# Altium project Mother_PCB_V2.PrjPcb
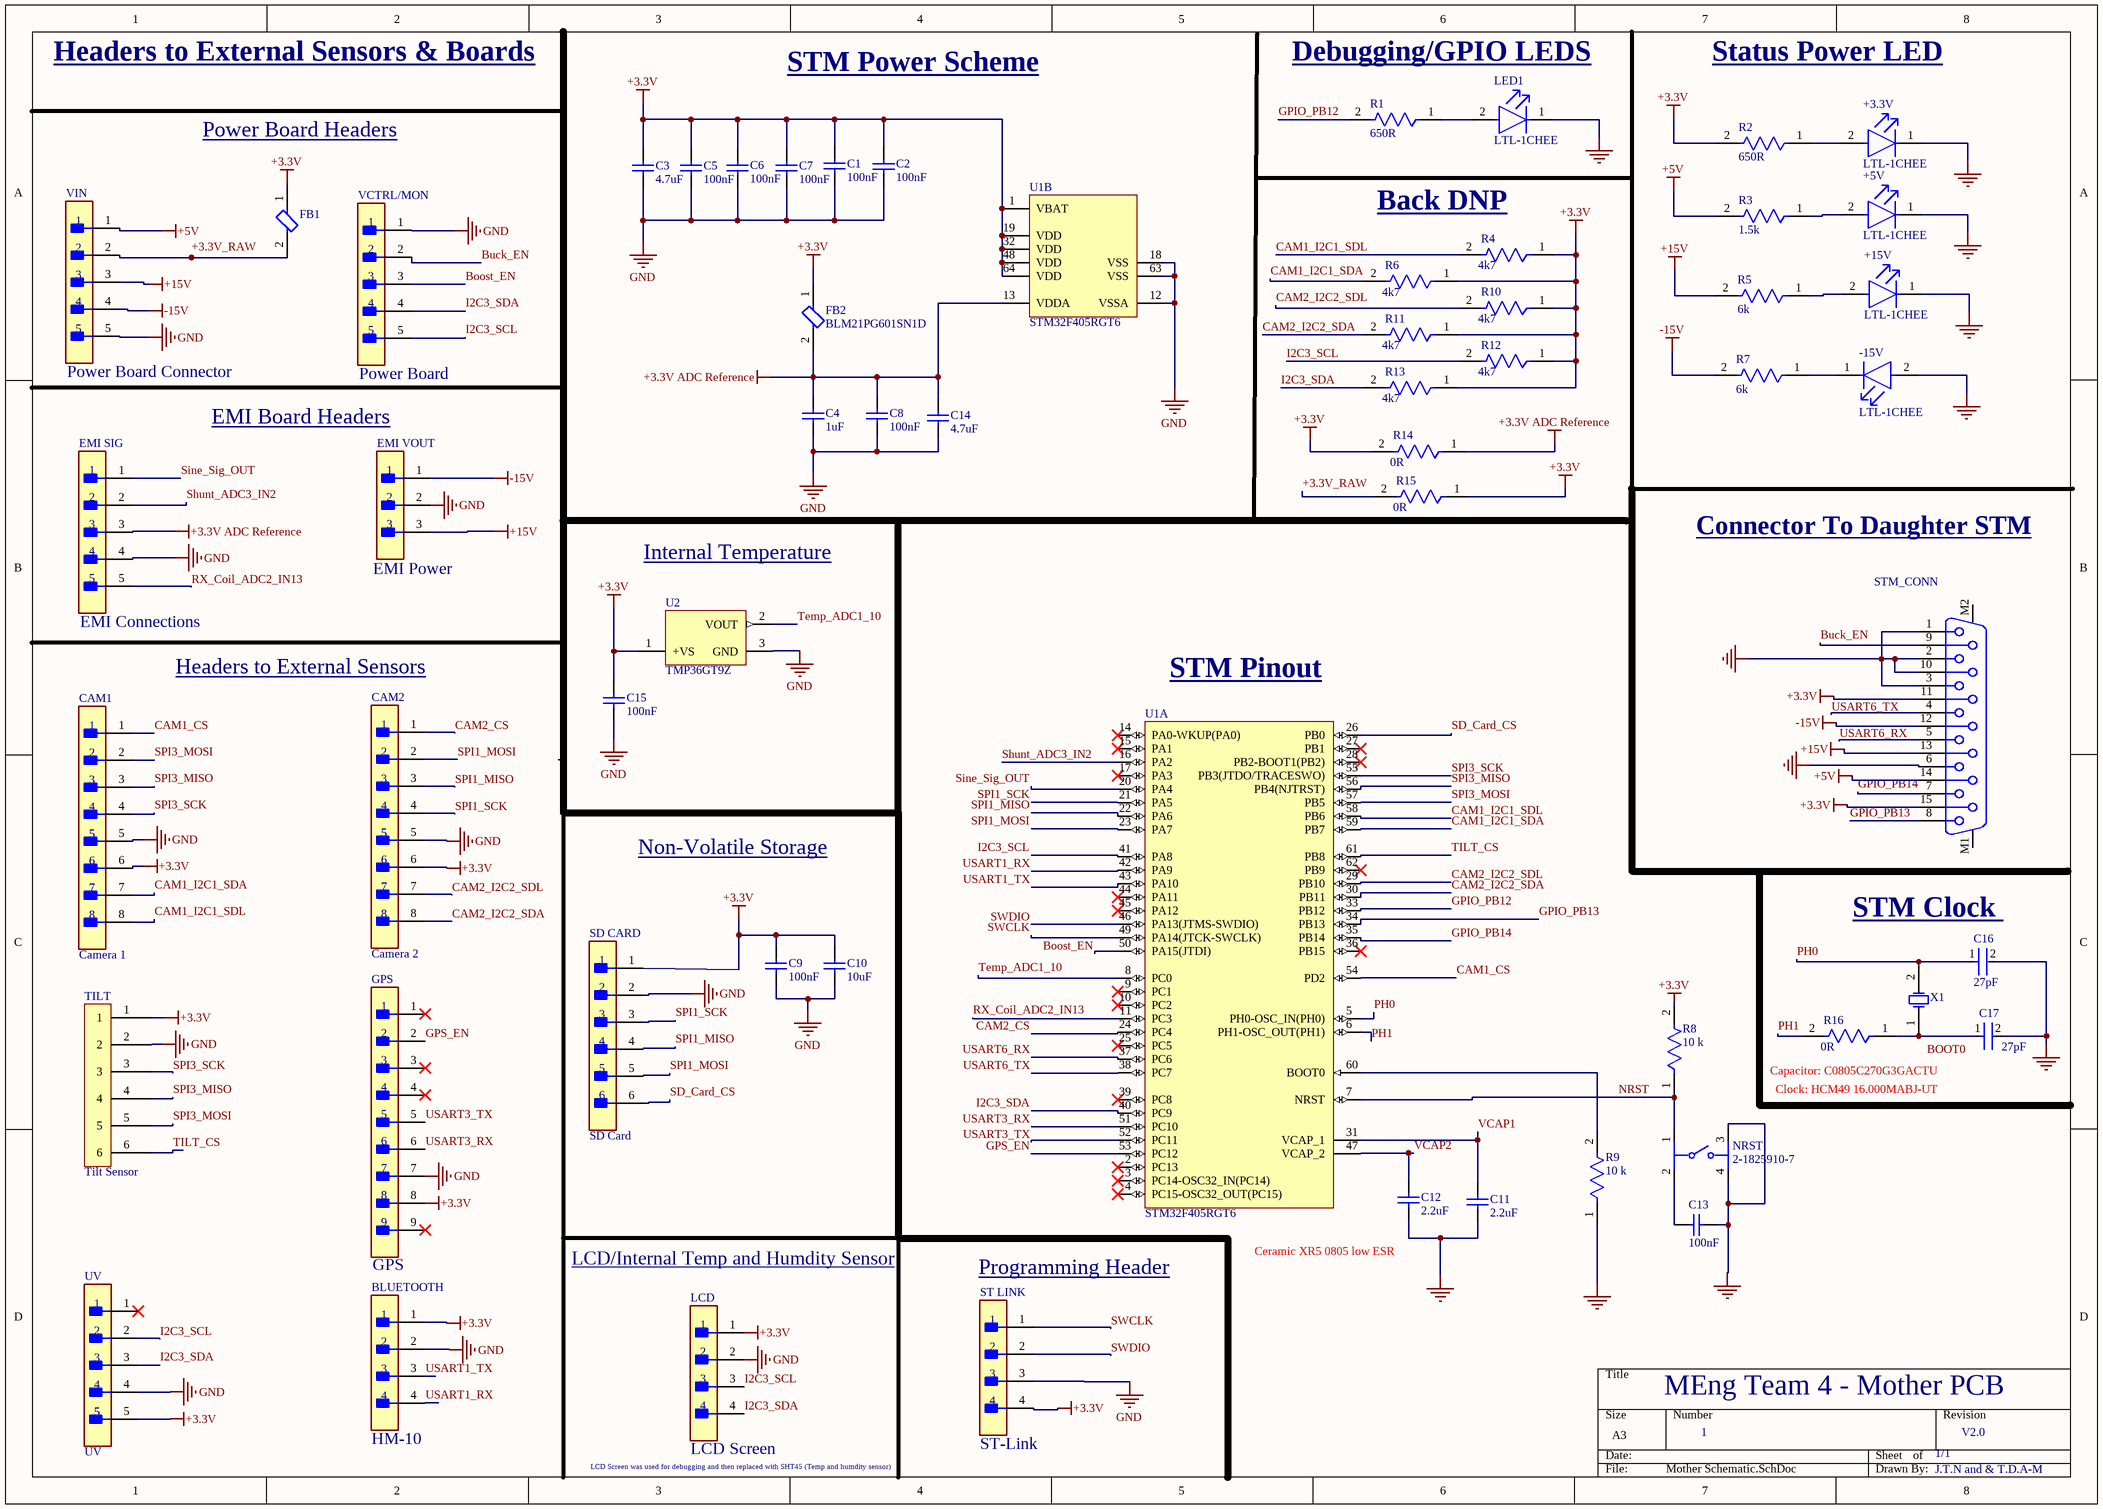
[diagram p0: Mother Schematic.SchDoc]
1 sheet, 58 parts. Net scope: global (net labels, ports and power ports of the same name join across sheets).
Board file: PCB1.PcbDoc

## Sheet Mother Schematic.SchDoc
size A3; SheetNumber: 1; SheetTotal: 1

### Parts
+3.3V  LTL-1CHEE  [FP-LTL-1CHEE-MFG]
+5V  LTL-1CHEE  [FP-LTL-1CHEE-MFG]
+15V  LTL-1CHEE  [FP-LTL-1CHEE-MFG]
-15V  LTL-1CHEE  [FP-LTL-1CHEE-MFG]
BLUETOOTH  HM-10  [FP-22-29-2041-MFG]
C1  100nF  [CAPC0805(2012)100_M]
C2  100nF  [CAPC0805(2012)100_M]
C3  4.7uF  [CAPC2013X140X50NL20T25]
C4  1uF  [CAPC2013X140X50NL20T25]
C5  100nF  [CAPC0805(2012)100_M]
C6  100nF  [CAPC0805(2012)100_M]
C7  100nF  [CAPC0805(2012)100_M]
C8  100nF  [CAPC0805(2012)100_M]
C9  100nF  [CAPC0805(2012)100_M]
C10  10uF  [CAPC0805(2012)100_M]
C11  2.2uF  [CAPC0805(2012)100_M]
C12  2.2uF  [CAPC0805(2012)100_M]
C13  100nF  [CAPC0805(2012)100_M]
C14  4.7uF  [CAPC2013X140X50NL20T25]
C15  100nF  [CAPC0805(2012)100_M]
C16  27pF  [FP-GRM21A-0_2-IPC_A]
C17  27pF  [FP-GRM21A-0_2-IPC_A]
CAM1  Camera 1  [FP-22-11-2082-MFG]
CAM2  Camera 2  [FP-22-11-2082-MFG]
EMI_SIG  EMI Connections  [FP-3-641215-5-MFG]
EMI_VOUT  EMI Power  [FP-09-65-2038-MFG]
FB1  BLM21PG601SN1D  [FP-BLM21-0_2-t0_85-e0_5-MFG]  (value not drawn)
FB2  BLM21PG601SN1D  [FP-BLM21-0_2-t0_85-e0_5-MFG]
GPS  GPS  [FP-22-29-2091-MFG]
LCD  LCD Screen  [FP-22-29-2041-MFG]
LED1  LTL-1CHEE  [FP-LTL-1CHEE-MFG]
NRST  2-1825910-7  [FP-2-1825910-7-MFG]
R1  650R  [FP-CRCW0805-e3-IPC_A]
R2  650R  [FP-CRCW0805-e3-IPC_A]
R3  1.5k  [FP-CRCW0805-e3-IPC_A]
R4  4k7  [FP-CRCW0805-e3-IPC_A]
R5  6k  [FP-CRCW0805-e3-IPC_A]
R6  4k7  [FP-CRCW0805-e3-IPC_A]
R7  6k  [FP-CRCW0805-e3-IPC_A]
R8  10 k  [FP-CRCW0805-e3-IPC_A]
R9  10 k  [FP-CRCW0805-e3-IPC_A]
R10  4k7  [FP-CRCW0805-e3-IPC_A]
R11  4k7  [FP-CRCW0805-e3-IPC_A]
R12  4k7  [FP-CRCW0805-e3-IPC_A]
R13  4k7  [FP-CRCW0805-e3-IPC_A]
R14  0R  [FP-CRCW0805-e3-IPC_A]
R15  0R  [FP-CRCW0805-e3-IPC_A]
R16  0R  [FP-CRCW0805-e3-IPC_A]
SD_CARD  SD Card  [FP-22-27-2061-MFG]
ST_LINK  ST-Link  [FP-22-29-2041-MFG]
STM_CONN  (no value)  [618015231321]
TILT  Tilt Sensor  [DIP24]
U1  STM32F405RGT6  [STM-LQFP64_M]  (parts A,B of 2)
U2  TMP36GT9Z  [ADI-T-3]
UV  UV  [FP-3-641215-5-MFG]
VCTRL/MON  Power Board  [FP-3-641215-5-MFG]
VIN  Power Board Connector  [FP-26-60-4050-MFG]
X1  HCM49-8.000MABJ-UT  [CFM-HCM49-2_V]  (value not drawn)

### Nets
+3.3V: BLUETOOTH.1 C1.2 C2.2 C3.2 C5.2 C6.2 C7.2 C9.2 C10.2 C15.2 CAM1.6 CAM2.6 FB1.1 FB2.1 GPS.8 LCD.1 R2.2 R4.1 R6.1 R8.2 R10.1 R11.1 R12.1 R13.1 R14.2 R15.1 SD_CARD.1 ST_LINK.4 STM_CONN.11 STM_CONN.15 TILT.1 U1.1(VBAT) U1.19(VDD) U1.32(VDD) U1.48(VDD) U1.64(VDD) U2.1(+VS) UV.5
+3.3V ADC Reference: C4.2 C8.2 C14.2 EMI_SIG.3 FB2.2 R14.1 U1.13(VDDA)
+5V: R3.2 STM_CONN.14 VIN.1
+15V: EMI_VOUT.3 R5.2 STM_CONN.13 VIN.3
-15V: EMI_VOUT.1 R7.2 STM_CONN.12 VIN.4
GND: +3.3V.1(C) +5V.1(C) +15V.1(C) -15V.2(A) BLUETOOTH.2 C1.1 C2.1 C3.1 C4.1 C5.1 C6.1 C7.1 C8.1 C9.1 C10.1 C11.1 C12.1 C13.1 C14.1 C15.1 C16.2 C17.2 CAM1.5 CAM2.5 EMI_SIG.4 EMI_VOUT.2 GPS.7 LCD.2 LED1.1(C) NRST.3 NRST.4 R9.1 SD_CARD.2 ST_LINK.3 STM_CONN.1 STM_CONN.2 STM_CONN.3 STM_CONN.6 STM_CONN.10 TILT.2 U1.12(VSSA) U1.18(VSS) U1.63(VSS) U2.3(GND) UV.4 VCTRL/MON.1 VIN.5
+3.3V_RAW: FB1.2 R15.2 VIN.2
Boost_EN: U1.50(PA15(JTDI)) VCTRL/MON.3
Buck_EN: STM_CONN.9 VCTRL/MON.2
CAM1_CS: CAM1.1 U1.54(PD2)
CAM1_I2C1_SDA: CAM1.7 R6.2 U1.59(PB7)
CAM1_I2C1_SDL: CAM1.8 R4.2 U1.58(PB6)
CAM2_CS: CAM2.1 U1.24(PC4)
CAM2_I2C2_SDA: CAM2.8 R11.2 U1.30(PB11)
CAM2_I2C2_SDL: CAM2.7 R10.2 U1.29(PB10)
GPIO_PB12: R1.2 U1.33(PB12)
GPIO_PB13: STM_CONN.8 U1.34(PB13)
GPIO_PB14: STM_CONN.7 U1.35(PB14)
GPS_EN: GPS.2 U1.53(PC12)
I2C3_SCL: LCD.3 R12.2 U1.41(PA8) UV.2 VCTRL/MON.5
I2C3_SDA: LCD.4 R13.2 U1.40(PC9) UV.3 VCTRL/MON.4
NRST: NRST.1 R8.1 U1.7(NRST)
PH0: C16.1 U1.5(PH0-OSC_IN(PH0)) X1.2(X2)
PH1: R16.2 U1.6(PH1-OSC_OUT(PH1))
RX_Coil_ADC2_IN13: EMI_SIG.5 U1.11(PC3)
SD_Card_CS: SD_CARD.6 U1.26(PB0)
Shunt_ADC3_IN2: EMI_SIG.2 U1.16(PA2)
Sine_Sig_OUT: EMI_SIG.1 U1.20(PA4)
SPI1_MISO: CAM2.3 SD_CARD.4 U1.22(PA6)
SPI1_MOSI: CAM2.2 SD_CARD.5 U1.23(PA7)
SPI1_SCK: CAM2.4 SD_CARD.3 U1.21(PA5)
SPI3_MISO: CAM1.3 TILT.4 U1.56(PB4(NJTRST))
SPI3_MOSI: CAM1.2 TILT.5 U1.57(PB5)
SPI3_SCK: CAM1.4 TILT.3 U1.55(PB3(JTDO/TRACESWO))
SWCLK: ST_LINK.1 U1.49(PA14(JTCK-SWCLK))
SWDIO: ST_LINK.2 U1.46(PA13(JTMS-SWDIO))
Temp_ADC1_10: U1.8(PC0) U2.2(VOUT)
TILT_CS: TILT.6 U1.61(PB8)
USART1_RX: BLUETOOTH.4 U1.42(PA9)
USART1_TX: BLUETOOTH.3 U1.43(PA10)
USART3_RX: GPS.6 U1.51(PC10)
USART3_TX: GPS.5 U1.52(PC11)
USART6_RX: STM_CONN.5 U1.37(PC6)
USART6_TX: STM_CONN.4 U1.38(PC7)
VCAP1: C11.2 U1.31(VCAP_1)
VCAP2: C12.2 U1.47(VCAP_2)
Net+3.3V_2: +3.3V.2(A) R2.1
Net+5V_2: +5V.2(A) R3.1
Net+15V_2: +15V.2(A) R5.1
Net-15V_1: -15V.1(C) R7.1
NetC13_2: C13.2 NRST.2
NetC17_1: C17.1 R16.1 X1.1(X1)
NetLED1_2: LED1.2(A) R1.1
NetR9_2: R9.2 U1.60(BOOT0)

Not connected (* = marked no-connect by the designer): GPS 1* 3* 4* 9*; STM_CONN M1 M2; U1 2(PC13)* 3(PC14-OSC32_IN(PC14))* 4(PC15-OSC32_OUT(PC15))* 9(PC1)* 10(PC2)* 14(PA0-WKUP(PA0))* 15(PA1)* 17(PA3)* 25(PC5)* 27(PB1)* 28(PB2-BOOT1(PB2))* 36(PB15)* 39(PC8)* 44(PA11)* 45(PA12)* 62(PB9)*; UV 1*

### Notes on the sheet
- Headers to External Sensors & Boards
- STM Power Scheme
- Debugging/GPIO LEDS
- Status Power LED
- Power Board Headers
- (near R4) Back DNP
- EMI Board Headers
- Internal Temperature
- Connector To Daughter STM
- (near CAM2) Headers to External Sensors
- (near U1) STM Pinout
- Non-Volatile Storage
- (near C16) STM Clock
- (near R16) Capacitor: C0805C270G3GACTU
- Clock: HCM49 16.000MABJ-UT
- Ceramic XR5 0805 low ESR
- LCD/Internal Temp and Humdity Sensor
- Programming Header
- MEng Team 4 - Mother PCB
- 1
- 1/1
- V2.0
- (near LCD) LCD Screen was used for debugging and then replaced with SHT45 (Temp and humdity sensor)
- J.T.N and & T.D.A-M
- Labels drawn without touching a wire or pin: BOOT0

### Library data of the parts
+3.3V +5V +15V -15V LED1 = CMP-22017-000040-1: LED RED CLEAR T/H; Viewing Angle: 45°; Power Dissipation: 100mW; Wavelength: 635nm; Number of LEDs: 1; Test Current: 10mA; Lens Style: Dome; Forward Current: 30mA; Forward Voltage: 2V; Luminous Intensity: 19mcd; Reverse Voltage: 5V; Dominant Wavelength: 625nm; RoHS Compliant: Yes; Mount: Through Hole; Diameter: 3.1mm; Package Quantity: 1000; Lens Transparency: Clear; Illumination Color: Red; Lens Color: Red; Max Operating Temperature: 100°C; Radiation Hardening: No; Case/Package: T; Width: 3.8mm; Length: 3.8mm; Depth: 3.8mm; Series: -; Number of Pins: 2; Number of Elements: 1; Height: 5.2mm; Max Power Dissipation: 100mW; Lead Free: Lead Free; Packaging: Bulk; Color: Red; Min Operating Temperature: -55°C
BLUETOOTH LCD ST_LINK = CMP-04776-000366-1: CONN HEADER VERT 4POS 2.54MM; Insulation Resistance: 50GR; Voltage Rating: 250V; Glow Wire Compliant: Non-compliant; Max Current Rating: 4A; Number of Circuits: 4; Contact Resistance: 10mR; Gender: Male; Number of Lines: 1; Length: 10.16mm; Radiation Hardening: No; Pitch: 2.54mm; Contact Material: Brass; Height: 11.7mm; Max Operating Temperature: 75°C; Flammability Rating: UL94 V-0; Mount: Through Hole; Voltage Rating (DC): 250V; Halogen Free: Low Halogen; Housing Color: White; Package Quantity: 1500; Series: KK® 6410; Number of Rows: 1; Housing Material: Nylon; Depth: 5.8mm; RoHS Compliant: Yes; Orientation: Straight; Contact Gender: Male; Color: Natural; Current Rating: 4A; Contact Mating Length: 0.295inch; Number of Poles: 4; Packaging: Bulk; Contact Type: Male Pin; Termination: Solder; Number of Positions: 4; Number of Contacts: 4; Lead Free: Lead Free; Min Operating Temperature: 0°C; Fastening Type: Friction; Contact Plating: Gold
C1 C2 C5-C13 C15 = CMP-1036-04393-1: CAP 100nF 10V ±5% 0805 (2012 Metric) Thickness 1mm SMD; Tolerance: Â±5%; Case-EIA: 0805; Case-Metric: 2012; Rated Voltage: 10 V; Technology: SMT; Value: 100nF; Max Thickness: 1 mm
C3 C4 C14 = CMP-2007-04673-1: Manufacturer: AVX Interconnect / Elco; Part Number: 0805ZC105KAT4A
C16 C17 = CMP-06035-033407-1: Chip Multilayer Ceramic Capacitors for General Purpose, 0805, 22pF, C0G, 30ppm/°C, 1%, 630V GRM21A5C2J220FWA1D
CAM1 CAM2 = CMP-04776-001014-1: CONN HEADER VERT 8POS 2.54MM; Number of Contacts: 8; Contact Resistance: 10mR; Max Current Rating: 1A; Current Rating: 4A; Gender: Male; Approvals: UL; Connector Type: Male Pin; Voltage Rating: 250V; Contact Type: Male Pin; Color: White; Height: 10.05mm; Fastening Type: Friction; Lead Free: Lead Free; Pitch: 2.54mm; Number of Positions: 8; Termination: Solder; Length: 20.32mm; Series: KK® 6373; Mount: Through Hole; Flammability Rating: UL94 V-0; Number of Circuits: 8; Min Operating Temperature: 0°C; Housing Material: Nylon; Depth: 6.35mm; Orientation: Straight; Packaging: Bulk; Housing Color: White; Contact Material: Brass; Contact Plating: Gold; Radiation Hardening: No; Max Operating Temperature: 75°C; Contact Mating Length: 0.295inch; Number of Rows: 1
EMI_SIG UV VCTRL/MON = CMP-03369-000062-1: CONN HEADER VERT 5POS 2.54MM; Manufacturer: TE Connectivity; Manufacturer Part Number: 3-641215-5; Voltage Rating: 250V; Conn Gender: Male; Conn Orientation: Vertical; Current Rating: 5A; Number Of Contacts: 5; Device Class L3: unset; Package: 3-641215-5; Digikey Description: CONN HEADER VERT 5POS 2.54MM; Device Class L1: Connectors; Temperature: -55°C to +105°C; Pitch: 2.54mm; RoHS: TRUE; ComponentLink2Description: Datasheet; Footprint Url: https://www.te.com/commerce/DocumentDelivery/DDEController?Action=showdoc&DocId=Customer+Drawing%7F641215%7FZ4%7Fpdf%7FEnglish%7FENG_CD_641215_Z4.pdf%7F3-641215-5; Height: 0.415inch; Temperature Range High: +105°C; Mouser Description: Headers & Wire Housings FRICTION LCK HDR 5P Straight Post gold; Automotive: No; Number Of Rows: 1; Device Class L2: Headers and Wire Housings; Contact Material: Gold,Nickel; Temperature Range Low: -55°C; ComponentLink2URL: https://www.te.com/commerce/DocumentDelivery/DDEController?Action=showdoc&DocId=Specification+Or+Standard%7F108-1050%7FL%7Fpdf%7FEnglish%7FENG_SS_108-1050_L.pdf%7F3-641215-5; Octopart: https://octopart.com/3-641215-5-te+connectivity-40938285; Category: Conn; Lead Free: Yes
EMI_VOUT = CMP-04776-000251-1: CONN HEADER VERT 3POS 3.96MM; Max Voltage Rating (AC): 250V; Gender: Male; Glow Wire Compliant: Non-compliant; Number of Contacts: 3; Contact Resistance: 10mR; Current Rating: 7A; Mating Cycles: 30; Pitch: 3.96mm; Radiation Hardening: No; Lead Free: Lead Free; Termination: Through Hole; Orientation: Straight; Housing Material: Nylon; RoHS Compliant: Yes; Number of Rows: 1; Color: Natural; Contact Material: Brass; Voltage Rating: 250V; Flammability Rating: UL94 V-2; Contact Gender: Male; Number of Positions: 3; Min Operating Temperature: -40°C; Package Quantity: 8000; Packaging: Bulk; Mount: Through Hole; Series: 5273; Contact Plating: Tin; Max Operating Temperature: 105°C; Halogen Free: Halogen Free; Housing Color: Natural; Voltage Rating (DC): 250V
FB1 FB2 = CMP-0686-00622-4: Chip Ferrite Bead, 0805, 22Ω @ 100MHz, 0.009Ω, 25%, 6A; Manufacturer Series: BLM21P; Resistance: 10mR; DC Resistance-Max: 9mR; Material: Steel; Number of Circuits: 1; Impedance: 22R; Shielding: Unshielded; DC Current: 6A; Termination: SMD/SMT; Max Operating Temperature: 125°C; Case Code (Metric): 2012; Radiation Hardening: No; Length: 2mm; Case Code (Imperial): 0805; RoHS Compliant: Yes; Max Current Rating: 6A; DC Resistance (DCR): 9mR; Case/Package: 0805; Core Material: Ferrite; Width: 1.25mm; Weight: 0.000194oz; Number of Pins: 2; Packaging: Tape and Reel; REACH SVHC: No SVHC; Tolerance: 25%; Height: 0.85mm; Number of Functions: 1; Lead Free: Lead Free; Terminal Finish: Tin; Number of Lines: 1; Package Quantity: 1; Series: BLM21P; Test Frequency: 100MHz; Min Operating Temperature: -55°C; Max DC Current: 6A; Current Rating: 6A; Depth: 1.25mm
GPS = CMP-00257-00277738-1: 22-29-2091 KK® 254 Wire-to-Board Header, Vertical, with Friction Lock, 9 Circuits, Gold (Au) Plating; NexarPartId: 277738; Current Rating: 4A; Number of Contacts: 9; Insulation Resistance: 50GΩ; Working Voltage: 250V; Connector Type: Male Pin; Pitch: 2.54mm; Gender: Male; Contact Resistance: 10mΩ; Glow Wire Compliant: Non-compliant; Halogen Free: Low Halogen; Flammability Rating: UL94 V-0; Orientation: Vertical; Voltage Rating: 250V; Housing Material: Nylon; RoHS: Compliant; Fastening Type: Friction; Mount: Through Hole; Number of Positions: 9; Max Operating Temperature: 75°C; Min Operating Temperature: 0°C; Packaging: Bulk; Number of Circuits: 9; Lead Free: Lead Free; Contact Plating: Gold; Lead Pitch: 2.54mm; Number of Rows: 1; Number of Pins: 9; Voltage Rating (DC): 250V; Color: Natural; Contact Mating Length: 7.493mm; Termination: Solder; Contact Material: Brass
NRST = CMP-03402-000004-1: SWITCH TACTILE SPST-NO 0.05A 24V; Manufacturer: TE Connectivity; Contact Current Rating: 50mA; Operating Force: 160gf; Electromechanical Life: 100000Cycles; Contact Resistance: 100mΩ; ComponentLink2Description: Datasheet; Height: 13.3mm; Digikey Description: SWITCH TACTILE SPST-NO 0.05A 24V; Device Class L2: Switches; Category: Switch; Device Class L3: Pushbutton Switches; Manufacturer Part Number: 2-1825910-7; Device Class L1: Electromechanical; Mount: Through Hole; Temperature Range High: +85°C; ComponentLink2URL: https://www.te.com/commerce/DocumentDelivery/DDEController?Action=showdoc&DocId=Customer+Drawing%7F1825910%7FC10%7Fpdf%7FEnglish%7FENG_CD_1825910_C10.pdf%7F2-1825910-7; RoHS: TRUE; Temperature: -35°C to +85°C; Mouser Description: Switch Tactile OFF (ON) SPST Extended Round Button PC Pins 0.05A 24VDC 100000Cycles 1.57N Thru-Hole Loose; Automotive: No; Voltage Rating Dc: 24V; Package: 2-1825910-7; Lead Free: Yes; Octopart: https://octopart.com/2-1825910-7-te+connectivity-42270510; Temperature Range Low: -35°C; Throw Configuration: SPST-NO
R1-R16 = CMP-2001-04067-2: RES Thick Film, 680Ω, 5%, 0.125W, 200ppm/°C, 0805; Resistance: 680R; Max Power Dissipation: 125mW; Voltage Rating: 150V; Case Code (Imperial): 0805; Packaging: Tape and Reel; Max Operating Temperature: 155°C; Temperature Coefficient: 200ppm/°C; Case/Package: 0805; Features: Automotive AEC-Q200; Width: 1.25mm; Contact Plating: Tin; Weight: 0.000194oz; Radiation Hardening: No; Case Code (Metric): 2012; Military Standard: Not; Lead Free: Lead Free; Length: 2mm; Depth: 1.25mm; Composition: Thick Film; Power Rating: 125mW; Height: 0.45mm; Min Operating Temperature: -55°C; Number of Terminations: 2; Number of Pins: 2; Tolerance: 5%; Package Quantity: 1; Voltage Rating (DC): 150V; Termination: SMD/SMT
SD_CARD = CMP-04776-000309-1: CONN HEADER VERT 6POS 2.54MM; Number of Contacts: 6; Current Rating: 4A; Voltage Rating (AC): 250V; Contact Resistance: 10mR; Hole Diameter: 1.02mm; Connector Type: Male Pin; Gender: Male; Mount: Through Hole; REACH SVHC: No SVHC; Number of Rows: 1; Contact Plating: Tin; Series: KK; Depth: 5.8mm; Flammability Rating: UL94 V-0; Contact Type: Male Pin; Lead Pitch: 2.54mm; Min Operating Temperature: 0°C; Pitch: 2.54mm; Radiation Hardening: No; Color: Natural; Length: 15.24mm; Termination: Solder; Orientation: Straight; Contact Material: Brass; Max Voltage Rating (AC): 250V; Housing Material: Nylon; Max Operating Temperature: 75°C; Working Voltage: 250V; Max Current Rating: 4A; Fastening Type: Friction; Voltage Rating: 250V; Housing Color: White; Packaging: Bulk; Material: Nylon; Contact Mating Length: 0.295inch; Package Quantity: 10000; Number of Positions: 6
STM_CONN = CMP-1502-00205-3: 15 Way Right Angle Through Hole Pcb D-sub Connector Socket, 2.77MM, 2.84MM Pitch; Insulation Resistance: 5GΩ; Number of Contacts: 15; Operating Supply Voltage: 125V; Current Rating: 3A; Contact Resistance: 30mΩ; Gender: Female; Number of Rows: 2; Contact Plating: Gold; Width: 12.5mm; Housing Material: Steel; Max Operating Temperature: 105°C; Number of Pins: 15; Length: 24.76mm; RoHS: Compliant; Voltage Rating: 125V; Depth: 20.75mm; Termination: SMD/SMT; Insulation Material: PBT; Min Operating Temperature: -55°C; Mount: Through Hole; Pitch: 2.77mm; Orientation: Right Angle
U1 = CMP-0243-00019-3: ARM Cortex-M4 32-bit MCU+FPU, 210 DMIPS, 1024 kB Flash, 192 kB Internal RAM, 51 I/Os, 64-pin LQFP, -40 to 85 degC, Tray; Manufacturer: STMicroelectronics; Supply Voltage(Vcc) min (V): 1.8; Supply Voltage(Vcc) max (V): 3.6; Internal RAM Size (kB): 192; I/Os (High Current): 51; D/A Converter: 2x12-bit; FLASH Size (Prog) (kB): 1024; Operating Frequency(F) (Processor speed) (MHz): 168; ComponentLink2Description: Datasheet; PackageVersion: Rev. 4, 06/2013; DatasheetVersion: Rev. 4; Core: ARM Cortex-M4; ComponentLink2URL: http://www.st.com/st-web-ui/static/active/en/resource/technical/document/datasheet/DM00037051.pdf; PackageReference: LQFP64; Packing: Tray; ComponentLink1Description: Manufacturer URL; ComponentLink3URL: http://www.st.com/st-web-ui/static/active/en/resource/technical/document/datasheet/DM00037051.pdf; ComponentLink3Description: Package Specification; Mounting Technology: Surface Mount; ComponentLink1URL: http://www.st.com/web/en/home.html; PackageDescription: 64-Pin Low Profile Quad Flat Package, 10 x 10 mm Body, 0.5 mm Pitch; PartNumber: STM32F405RGT6
U2 = CMP-0887-00067-1: Low Voltage Temperature Sensor, 2.7 to 5.5 V Supply, Industrial, 3-pin TO92 (T-3), Tray; Manufacturer: Analog Devices; ComponentLink2Description: Datasheet; PackageReference: T-3; Packing: Tray; ComponentLink2URL: http://www.analog.com/static/imported-files/data_sheets/TMP35_36_37.pdf; ComponentLink4Description: Product URL; ComponentLink3Description: Package Specification; Code_JEDEC: TO-226-AA; PartNumber: TMP36GT9Z; PackageDescription: 3-Pin Plastic Header-Style Package, 1.27 mm Pitch; PackageVersion: 042208-A, 04/2008; ComponentLink3URL: http://www.analog.com/static/imported-files/packages/PKG_PDF/TO-92(T)/T_3.pdf; ComponentLink1Description: Manufacturer URL; Supply Voltage Range: 2.7 to 5.5 V; Mounting Technology: Through Hole; DatasheetVersion: Rev. F; ComponentLink4URL: http://www.analog.com/en/mems-sensors/digital-temperature-sensors/tmp36/products/product.html; ComponentLink1URL: http://www.analog.com/en/index.html
VIN = CMP-04776-000344-1: CONN HEADER VERT 5POS 3.96MM; Voltage Rating: 250V; Insulation Resistance: 50GR; Number of Lines: 1; Number of Positions: 5; Approvals: UL; Gender: Male; Glow Wire Compliant: Non-compliant; Contact Resistance: 6mR; Current Rating: 7A; Housing Color: Natural; Pitch: 3.96mm; Color: Natural; Contact Material: Brass; Flammability Rating: UL94 V-0; Contact Gender: Male; Number of Rows: 1; Max Operating Temperature: 75°C; Radiation Hardening: No; Series: KK® 41791; Voltage Rating (DC): 250V; Contact Mating Length: 0.45inch; Lead Free: Lead Free; Mount: Through Hole; Housing Material: Polyester; Orientation: Straight; Contact Plating: Tin; Min Operating Temperature: 0°C; Contact Type: Male Pin; Fastening Type: Friction; Material: Polyester; Termination: Solder; Number of Poles: 5; Depth: 10.01mm; RoHS Compliant: Yes; Package Quantity: 400; Number of Circuits: 5; Packaging: Bulk; Max Voltage Rating (AC): 250V; Number of Contacts: 5
X1 = CMP-1215-00001-1: At-Cut Crystal Unit, 3.5 to 30 MHz, -40 to 85 degC, 2-Pin 11.4Ã—4.7Ã—4.3 mm SMD, RoHS, Reel; Manufacturer: Citizen Finetech Miyota; DL: 100 uW; C0: 7 pF Max.; R1: 50 to 200 Ohm; IR: 500 MOhm Min.; f0: 3.5 to 30 MHz; Mounting Technology: Surface Mount; Packing: Reel; ComponentLink2URL: http://cfm.citizen.co.jp/english/product/pdf/HCM49.pdf; PartNumber: HCM49-8.000MABJ-UT; Operating Temperature: -40 to 85 degC; ComponentLink3URL: http://cfm.citizen.co.jp/english/product/pdf/HCM49.pdf; ComponentLink2Description: Datasheet; ComponentLink3Description: Package Specification; ComponentLink1Description: Manufacturer URL; PackageDescription: 2-Pin Surface Mount, Body 11.4 x 4.7 mm, Pitch 8.5 mm; DatasheetVersion: Jan-12; RoHS: TRUE; ComponentLink1URL: http://cfm.citizen.co.jp/english/index.html